# Altium schematic sheet USBHUB.SchDoc: OCULUS RIFT DEVELOPMENT KIT 2 (DK2) MAIN BOARD
size B; Date: 12 MAR 2014; Author: L. BAINBRIDGE; CompanyName: Oculus VR, Inc.; DrawnBy: L. BAINBRIDGE; Engineer: L. BAINBRIDGE; Organization: Oculus VR, Inc.; DocumentNumber: 3; Revision: 3.3; SheetNumber: 3; SheetTotal: 6; PageSetup: Record=PageOptions|CenterHorizontal=True|CenterVertical=True|PrintScale=1.12|XCorrection=1.00|YCorrection=1.00|PrintKind=1|BorderSize=5000000|LeftOffset=0|BottomOffset=0|Orientation=2|PaperLength=1000|PaperWidth=1000|Scale=100|PaperSource=15|PrintQuality=1200|MediaType=1|DitherType=0|PaperKind=11 x 17|PrintScaleMode=1; SheetDescription: USB HIGH SPEED HUB AND SUPPORTING CIRCUITS; PartNumber: N/A; ProjectName: DK2
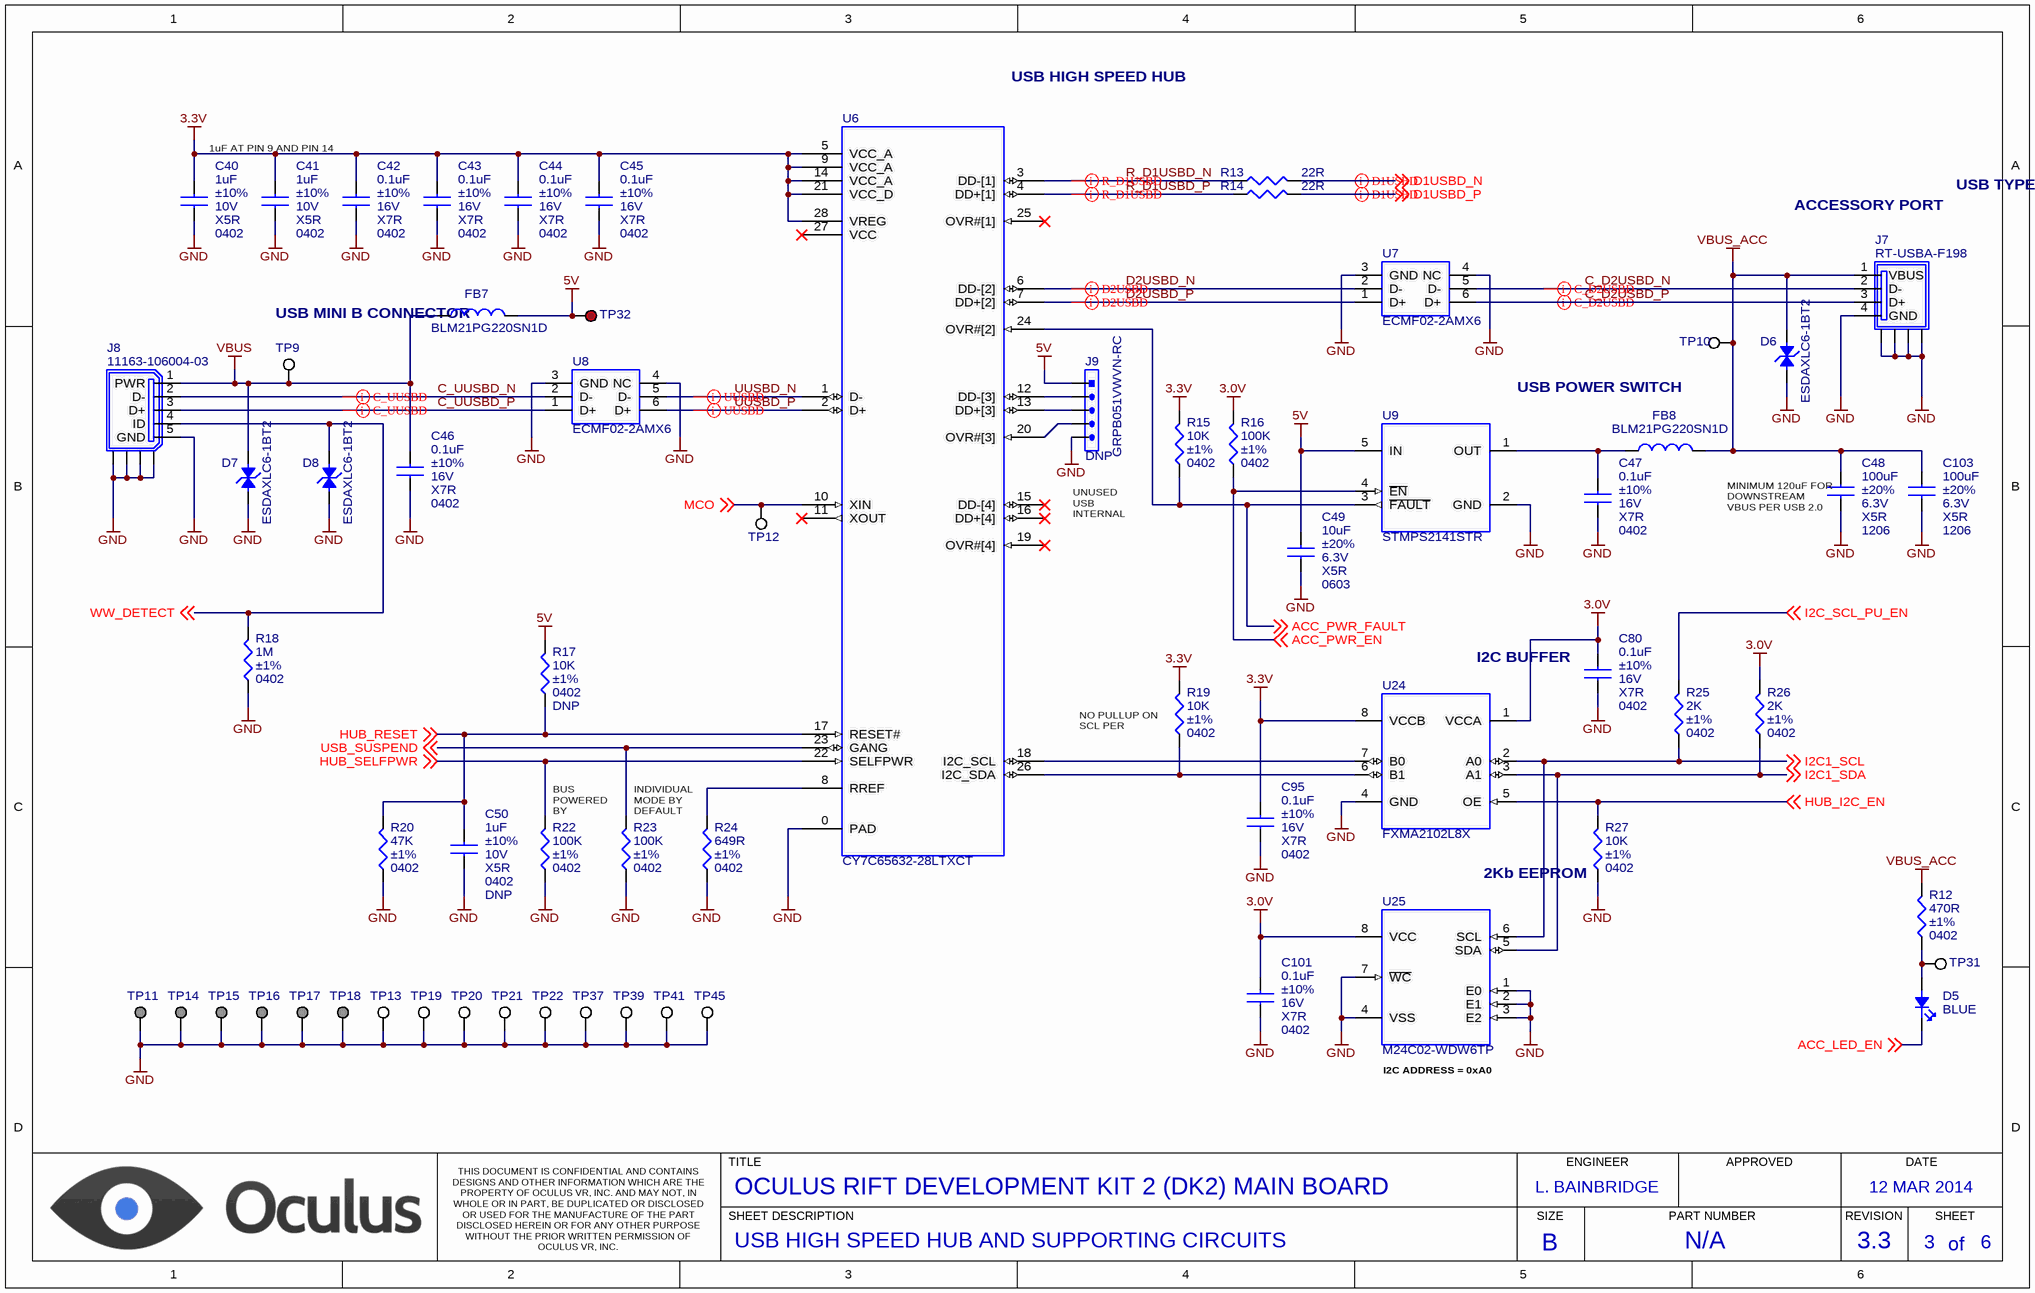
[diagram p0: USBHUB.SchDoc]

## Parts
C40  1uF  Tolerance: ±10%  Voltage: 10V  Dielectric: X5R  Package: 0402  [CAP_CERAMIC_0402]
C41  1uF  Tolerance: ±10%  Voltage: 10V  Dielectric: X5R  Package: 0402  [CAP_CERAMIC_0402]
C42  0.1uF  Tolerance: ±10%  Voltage: 16V  Dielectric: X7R  Package: 0402  [CAP_CERAMIC_0402]
C43  0.1uF  Tolerance: ±10%  Voltage: 16V  Dielectric: X7R  Package: 0402  [CAP_CERAMIC_0402]
C44  0.1uF  Tolerance: ±10%  Voltage: 16V  Dielectric: X7R  Package: 0402  [CAP_CERAMIC_0402]
C45  0.1uF  Tolerance: ±10%  Voltage: 16V  Dielectric: X7R  Package: 0402  [CAP_CERAMIC_0402]
C46  0.1uF  Tolerance: ±10%  Voltage: 16V  Dielectric: X7R  Package: 0402  [CAP_CERAMIC_0402]
C47  0.1uF  Tolerance: ±10%  Voltage: 16V  Dielectric: X7R  Package: 0402  [CAP_CERAMIC_0402]
C48  100uF  Tolerance: ±20%  Voltage: 6.3V  Dielectric: X5R  Package: 1206  [CAP_CERAMIC_1206]
C49  10uF  Tolerance: ±20%  Voltage: 6.3V  Dielectric: X5R  Package: 0603  [CAP_CERAMIC_0603]
C50  1uF  Tolerance: ±10%  Voltage: 10V  Dielectric: X5R  Package: 0402  [CAP_CERAMIC_0402]  (no BOM)
C80  0.1uF  Tolerance: ±10%  Voltage: 16V  Dielectric: X7R  Package: 0402  [CAP_CERAMIC_0402]
C95  0.1uF  Tolerance: ±10%  Voltage: 16V  Dielectric: X7R  Package: 0402  [CAP_CERAMIC_0402]
C101  0.1uF  Tolerance: ±10%  Voltage: 16V  Dielectric: X7R  Package: 0402  [CAP_CERAMIC_0402]
C103  100uF  Tolerance: ±20%  Voltage: 6.3V  Dielectric: X5R  Package: 1206  [CAP_CERAMIC_1206]
D5  Color: BLUE  [LED_BLUE_0603]  (hidden comment: LED)
D6  ESDAXLC6-1BT2  [SOD-882T]
D7  ESDAXLC6-1BT2  [SOD-882T]
D8  ESDAXLC6-1BT2  [SOD-882T]
FB7  BLM21PG220SN1D  [INDUCTOR_0805]
FB8  BLM21PG220SN1D  [INDUCTOR_0805]
J7  RT-USBA-F198  [RT-USBA-F198]
J8  11163-106004-03  [BW_11163-106004-03]
J9  GRPB051VWVN-RC  [GRPB051VWVN-RC]  (no BOM)
R12  470R  Package: 0402  Tolerance: ±1%  [RESISTOR_0402]
R13  22R  [RESISTOR_0402]
R14  22R  [RESISTOR_0402]
R15  10K  Package: 0402  Tolerance: ±1%  [RESISTOR_0402]
R16  100K  Package: 0402  Tolerance: ±1%  [RESISTOR_0402]
R17  10K  Package: 0402  Tolerance: ±1%  [RESISTOR_0402]  (no BOM)
R18  1M  Package: 0402  Tolerance: ±1%  [RESISTOR_0402]
R19  10K  Package: 0402  Tolerance: ±1%  [RESISTOR_0402]
R20  47K  Package: 0402  Tolerance: ±1%  [RESISTOR_0402]
R22  100K  Package: 0402  Tolerance: ±1%  [RESISTOR_0402]
R23  100K  Package: 0402  Tolerance: ±1%  [RESISTOR_0402]
R24  649R  Package: 0402  Tolerance: ±1%  [RESISTOR_0402]
R25  2K  Package: 0402  Tolerance: ±1%  [RESISTOR_0402]
R26  2K  Package: 0402  Tolerance: ±1%  [RESISTOR_0402]
R27  10K  Package: 0402  Tolerance: ±1%  [RESISTOR_0402]
TP9  TEST POINT  [TEST_POINT_PAD_1.2X3MM]  (value not drawn)  (no BOM)
TP10  TEST POINT  [TEST_POINT_PAD_1MM]  (value not drawn)  (no BOM)
TP11  TEST POINT BLACK  [KS_5001_TEST_POINT_BLACK]  (value not drawn)  (no BOM)
TP12  TEST POINT  [TEST_POINT_PAD_1MM]  (value not drawn)  (no BOM)
TP13  TEST POINT  [TEST_POINT_PAD_1.2X3MM]  (value not drawn)  (no BOM)
TP14  TEST POINT BLACK  [KS_5001_TEST_POINT_BLACK]  (value not drawn)  (no BOM)
TP15  TEST POINT BLACK  [KS_5001_TEST_POINT_BLACK]  (value not drawn)  (no BOM)
TP16  TEST POINT BLACK  [KS_5001_TEST_POINT_BLACK]  (value not drawn)  (no BOM)
TP17  TEST POINT BLACK  [KS_5001_TEST_POINT_BLACK]  (value not drawn)  (no BOM)
TP18  TEST POINT BLACK  [KS_5001_TEST_POINT_BLACK]  (value not drawn)  (no BOM)
TP19  TEST POINT  [TEST_POINT_PAD_1MM]  (value not drawn)  (no BOM)
TP20  TEST POINT  [TEST_POINT_PAD_1MM]  (value not drawn)  (no BOM)
TP21  TEST POINT  [TEST_POINT_PAD_1MM]  (value not drawn)  (no BOM)
TP22  TEST POINT  [TEST_POINT_PAD_1MM]  (value not drawn)  (no BOM)
TP31  TEST POINT  [TEST_POINT_PAD_1MM]  (value not drawn)  (no BOM)
TP32  TEST POINT RED  [KS_500X_TEST_POINT]  (value not drawn)  (no BOM)
TP37  TEST POINT  [TEST_POINT_PAD_1MM]  (value not drawn)  (no BOM)
TP39  TEST POINT  [TEST_POINT_PAD_1MM]  (value not drawn)  (no BOM)
TP41  TEST POINT  [TEST_POINT_PAD_1MM]  (value not drawn)  (no BOM)
TP45  TEST POINT  [TEST_POINT_PAD_1MM]  (value not drawn)  (no BOM)
U6  CY7C65632-28LTXCT  [QFN-28]
U7  ECMF02-2AMX6  [UQFN-6L]
U8  ECMF02-2AMX6  [UQFN-6L]
U9  STMPS2141STR  [SOT23-5L]
U24  FXMA2102L8X  [UFQFN-8]
U25  M24C02-WDW6TP  [TSSOP8]

## Nets
3.0V: C80.1 C101.1 R16.2 R26.2 U24.1(VCCA) U25.8(VCC)
3.3V: C40.1 C41.1 C42.1 C43.1 C44.1 C45.1 C95.1 R15.2 R19.2 U6.5(VCC_A) U6.9(VCC_A) U6.14(VCC_A) U6.21(VCC_D) U6.28(VREG) U24.8(VCCB)
5V: C49.1 FB7.2 J9.1 R17.2 TP32.1 U9.5(IN)
GND: C40.2 C41.2 C42.2 C43.2 C44.2 C45.2 C46.2 C47.2 C48.2 C49.2 C50.2 C80.2 C95.2 C101.2 C103.2 D6.2 D7.2 D8.2 J7.4(GND) J7.5(SHIELD) J7.6(SHIELD) J7.7(SHIELD) J7.8(SHIELD) J8.5(GND) J8.6(SHIELD) J8.7(SHIELD) J8.8(SHIELD) J8.9(SHIELD) J9.5 R18.1 R20.1 R22.1 R23.1 R24.1 R27.1 TP11.1 TP13.1 TP14.1 TP15.1 TP16.1 TP17.1 TP18.1 TP19.1 TP20.1 TP21.1 TP22.1 TP37.1 TP39.1 TP41.1 TP45.1 U6.0(PAD) U7.3(GND) U7.4(NC) U8.3(GND) U8.4(NC) U9.2(GND) U24.4(GND) U25.1(E0) U25.2(E1) U25.3(E2) U25.4(VSS) U25.7(~{WC})
VBUS: C46.1 D7.1 FB7.1 J8.1(PWR) TP9.1
VBUS_ACC: C48.1 C103.1 D6.1 FB8.2 J7.1(VBUS) R12.2 TP10.1
ACC_LED_EN: D5.2(K) ; off-sheet ACC_LED_EN
ACC_PWR_EN: R16.1 U9.4(~{EN}) ; off-sheet ACC_PWR_EN
ACC_PWR_FAULT: R15.1 U6.24(OVR#[2]) U9.3(~{FAULT}) ; off-sheet ACC_PWR_FAULT
C_D2USBD_N: J7.2(D-) U7.5(D-)
C_D2USBD_P: J7.3(D+) U7.6(D+)
C_UUSBD_N: J8.2(D-) U8.2(D-)
C_UUSBD_P: J8.3(D+) U8.1(D+)
D1USBD_N: R13.2 ; off-sheet D1USBD_N
D1USBD_P: R14.2 ; off-sheet D1USBD_P
D2USBD_N: U6.6(DD-[2]) U7.2(D-)
D2USBD_P: U6.7(DD+[2]) U7.1(D+)
HUB_I2C_EN: R27.2 U24.5(OE) ; off-sheet HUB_I2C_EN
HUB_RESET: C50.1 R17.1 R20.2 U6.17(RESET#) ; off-sheet HUB_RESET
HUB_SELFPWR: R22.2 U6.22(SELFPWR) ; off-sheet HUB_SELFPWR
I2C1_SCL: R25.1 U24.2(A0) U25.6(SCL) ; off-sheet I2C1_SCL
I2C1_SDA: R26.1 U24.3(A1) U25.5(SDA) ; off-sheet I2C1_SDA
I2C_SCL_PU_EN: R25.2 ; off-sheet I2C_SCL_PU_EN
MCO: TP12.1 U6.10(XIN) ; off-sheet MCO
R_D1USBD_N: R13.1 U6.3(DD-[1])
R_D1USBD_P: R14.1 U6.4(DD+[1])
USB_SUSPEND: R23.2 U6.23(GANG) ; off-sheet USB_SUSPEND
UUSBD_N: U6.1(D-) U8.5(D-)
UUSBD_P: U6.2(D+) U8.6(D+)
WW_DETECT: D8.1 J8.4(ID) R18.2 ; off-sheet WW_DETECT
NetC47_1: C47.1 FB8.1 U9.1(OUT)
NetD5_1: D5.1(A) R12.1 TP31.1
NetJ9_2: J9.2 U6.12(DD-[3])
NetJ9_3: J9.3 U6.13(DD+[3])
NetJ9_4: J9.4 U6.20(OVR#[3])
NetR19_1: R19.1 U6.26(I2C_SDA) U24.6(B1)
NetR24_2: R24.2 U6.8(RREF)
NetU6_18: U6.18(I2C_SCL) U24.7(B0)

Not connected (* = marked no-connect by the designer): U6 11(XOUT)* 15(DD-[4])* 16(DD+[4])* 19(OVR#[4])* 25(OVR#[1])* 27(VCC)*

## Layout directives
differential pair: C_D2USBD_N, C_D2USBD_P, C_UUSBD_N, C_UUSBD_P, D1USBD_N, D1USBD_P, D2USBD_N, D2USBD_P, R_D1USBD_N, R_D1USBD_P, UUSBD_N, UUSBD_P

## Notes on the sheet
- USB HIGH SPEED HUB
- 1uF AT PIN 9 AND PIN 14
- ACCESSORY PORT
- USB TYPE A CONNECTOR
- USB MINI B CONNECTOR
- USB POWER SWITCH
- (near C48) MINIMUM 120uF FOR DOWNSTREAM VBUS PER USB 2.0 SPEC
- UNUSED USB INTERNAL BREAKOUT
- I2C BUFFER
- (near R19) NO PULLUP ON SCL PER CYPRESS SPEC
- BUS POWERED  BY DEFAULT
- INDIVIDUAL MODE BY DEFAULT
- 2Kb EEPROM
- (near U25) I2C ADDRESS = 0xA0
- TITLE
- ENGINEER
- APPROVED
- DATE
- THIS DOCUMENT IS CONFIDENTIAL AND CONTAINS DESIGNS AND OTHER INFORMATION WHICH ARE THE PROPERTY OF OCULUS VR, INC. AND MAY NOT, IN WHOLE OR IN PART, BE DUPLICATED OR DISCLOSED OR USED FOR THE MANUFACTURE OF THE PART DISCLOSED HEREIN OR FOR ANY OTHER PURPOSE WITHOUT THE PRIOR WRITTEN PERMISSION OF OCULUS VR, INC.
- SHEET DESCRIPTION
- SIZE
- PART NUMBER
- REVISION
- SHEET
- of
- B

## Library data of the parts
C40 C41 C50 = CAP, CERAMIC: CAP, CERAMIC, 1uF, ±10%, 10V, X5R, 0402; Manufacturer: MURATA ELECTRONICS; Part Number: GRM155R61A105KE15D
  C50: DNP: DNP
C42-C47 C80 C95 C101 = CAP, CERAMIC: CAP, CERAMIC, 0.1uF, ±10%, 16V, X7R, 0402; Manufacturer: MURATA ELECTRONICS; Part Number: GRM155R71C104KA88D
C48 C103 = CAP, CERAMIC: CAP, CERAMIC, 100uF, ±20%, 6.3V, X5R, 1206; Manufacturer: MURATA ELECTRONICS; Part Number: GRM31CR60J107ME39K
C49 = CAP, CERAMIC: CAP, CERAMIC, 10uF, ±20%, 6.3V, X5R, 0603; Manufacturer: MURATA ELECTRONICS; Part Number: GRM188R60J106ME47D
D5 = LED: LED, BLUE, 0603; Manufacturer: PANASONIC; Part Number: LNJ926W8CRA; Forward Voltage Drop: 2.9V TYP, 3.15V MAX
D6-D8 = ESDAXLC6-1BT2: DIODE, ESD SUPPRESSOR, SINGLE LINE BI-DIRECTIONAL, LOW CAPACITANCE; Manufacturer: ST MICROELECTRONICS; Part Number: ESDAXLC6-1BT2
FB7 FB8 = INDUCTOR: FERRITE CHIP BEAD, 22 OHM @ 100MHz, 6A, 0805; Manufacturer: MURATA ELECTRONICS; Part Number: BLM21PG220SN1D; Package: 0805; Impedance: 22 ohm @ 100MHz
J7 = RT-USBA-F198: CONNECTOR, USB TYPE A RECEPTICLE, MID MOUNT; Manufacturer: BERWAY TECHNOLOGY; Part Number: RT-USBA-F198
J8 = BW_11163-106004-03: CONNECTOR, USB MINI B, R/A, SMD; Manufacturer: BERWAY TECHNOLOGY; Part Number: 11163-106004-03
J9 = GRPB051VWVN-RC: CONNECTOR, HEADER, 1X5, 0.05" PITCH; Manufacturer: SULLINS CONNECTOR; Part Number: GRPB051VWVN-RC; DNP: DNP
R12 = RESISTOR: RES, 470 OHM, 1/10W, ±1%, 0402; Manufacturer: PANASONIC; Part Number: ERJ-2RKF4700X; Power Rating: 1/10W
R13 R14 = RESISTOR: RES, 22 OHM, 1/10W, ±1%, 0402; Manufacturer: PANASONIC; Part Number: ERJ-2RKF22R0X; Power Rating: 1/10W; Package: 0402; Tolerance: ±1%
R15 R17 R19 R27 = RESISTOR: RES, 10K OHM, 1/10W, ±1%, 0402; Manufacturer: PANASONIC; Part Number: ERJ-2RKF1002X; Power Rating: 1/10W
  R17: DNP: DNP
R16 R22 R23 = RESISTOR: RES, 100K OHM, 1/10W, ±1%, 0402; Manufacturer: PANASONIC; Part Number: ERJ-2RKF1003X; Power Rating: 1/10W
R18 = RESISTOR: RES, 1M OHM, 1/10W, ±1%, 0402; Manufacturer: PANASONIC; Part Number: ERJ-2RKF1004X; Power Rating: 1/10W
R20 = RESISTOR: RES, 47K OHM, 1/10W, ±1%, 0402; Manufacturer: PANASONIC; Part Number: ERJ-2RKF4702X; Power Rating: 1/10W
R24 = RESISTOR: RES, 649 OHM, 1/10W, ±1%, 0402; Manufacturer: PANASONIC; Part Number: ERJ-2RKF6490X; Power Rating: 1/10W
R25 R26 = RESISTOR: RES, 2K OHM, 1/10W, ±1%, 0402; Manufacturer: PANASONIC; Part Number: ERJ-2RKF2001X; Power Rating: 1/10W
TP9 TP10 TP12 TP13 TP19-TP22 TP31 TP37 TP39 TP41 TP45 = TEST_POINT_GENERIC: Manufacturer: *; Part Number: *
TP11 TP14-TP18 = TEST_POINT_BLACK: Manufacturer: KEYSTONE ELECTRONICS; Part Number: 5001
TP32 = TEST_POINT_RED: Manufacturer: KEYSTONE ELECTRONICS; Part Number: 5000
U6 = CY7C65632-28LTXCT: IC, USB 2.0 HUB CONTROLLER, 4-PORT, STT; Manufacturer: CYPRESS SEMICONDUCTOR; Part Number: CY7C65632-28LTXCT; Verified Pinout: *
U7 U8 = ECMF02-2AMX6: IC, COMMON MODE FILTER WITH ESD PROTECTION FOR MIPI; Manufacturer: STMICROELECTRONICS; Part Number: ECMF02-2AMX6; Verified Pinout: *
U9 = STMPS2141STR: IC, USB POWER DISTRIBUTION SWITCH, 500mA CURRENT LIMIT; Manufacturer: STMICROELECTRONICS; Part Number: STMPS2141STR; Pinout verified: *
U24 = FXMA2102L8X: IC, I2C TRANSLATOR, BUFFER AND REPEATER; Manufacturer: FAIRCHILD SEMICONDUCTOR; Part Number: FXMA2102L8X; Verified Pinout: *
U25 = M24C02-WDW6TP: IC, EEPROM, I2C, 2kB; Manufacturer: STMICROELECTRONICS; Part Number: M24C02-WDW6TP; Verified Pinout: *